# Altium schematic sheet FPC-v3.1.SchDoc
size A4; SheetNumber: 1; SheetTotal: 2
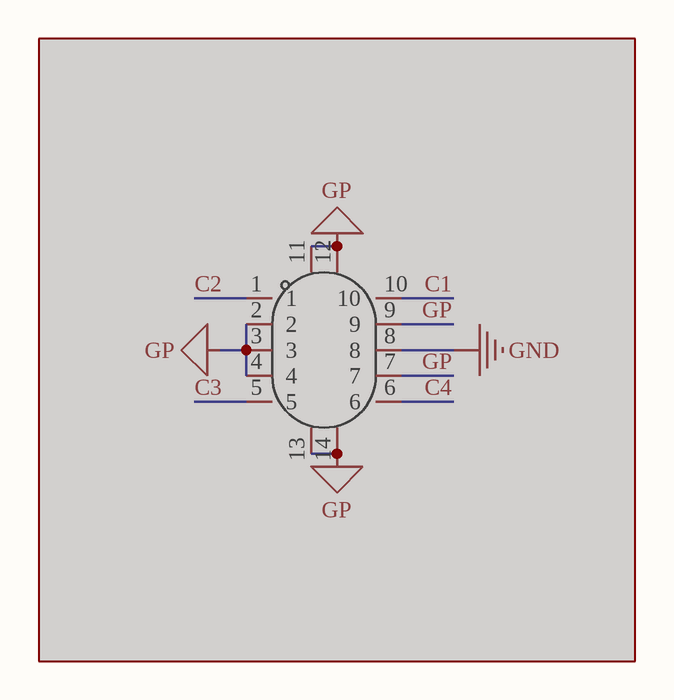
[diagram p0: FPC-v3.1.SchDoc]

## Parts
J1  BM24-10DP/2-0.35V(51)  [CONN-SMD_BM24-10DP-2-0.35V-51]  (value not drawn)  (masked out: inside a compile mask, not in the netlist)

## Library data of the parts
J1 = BM24-10DP/2-0.35V(51): 板对板连接器; Manufacturer: HRS(广濑); Add into BOM: yes; Pitch: 0.35mm; Gender: 公; Current Rating (Max): 5A; Name: BM24-10DP/2-0.35V(51); Symbol: BM24-10DP/2-0.35V(51); Device: BM24-10DP/2-0.35V(51); LCSC Part Name: BTB板对板,BM24系列,0.35间距,10PIN公座; Supplier Part: C424554; Manufacturer Part: BM24-10DP/2-0.35V(51); Supplier Footprint: SMD,P=0.35mm; JLCPCB Part Class: Extended Part; Supplier: LCSC; Convert to PCB: yes; Number of Pins: 10; Number of Rows: 2; Mounting Style: 立贴; Operating Temperature Range: -40℃~+85℃